# EAGLE design tmp006 (EAGLE 7.3.0)
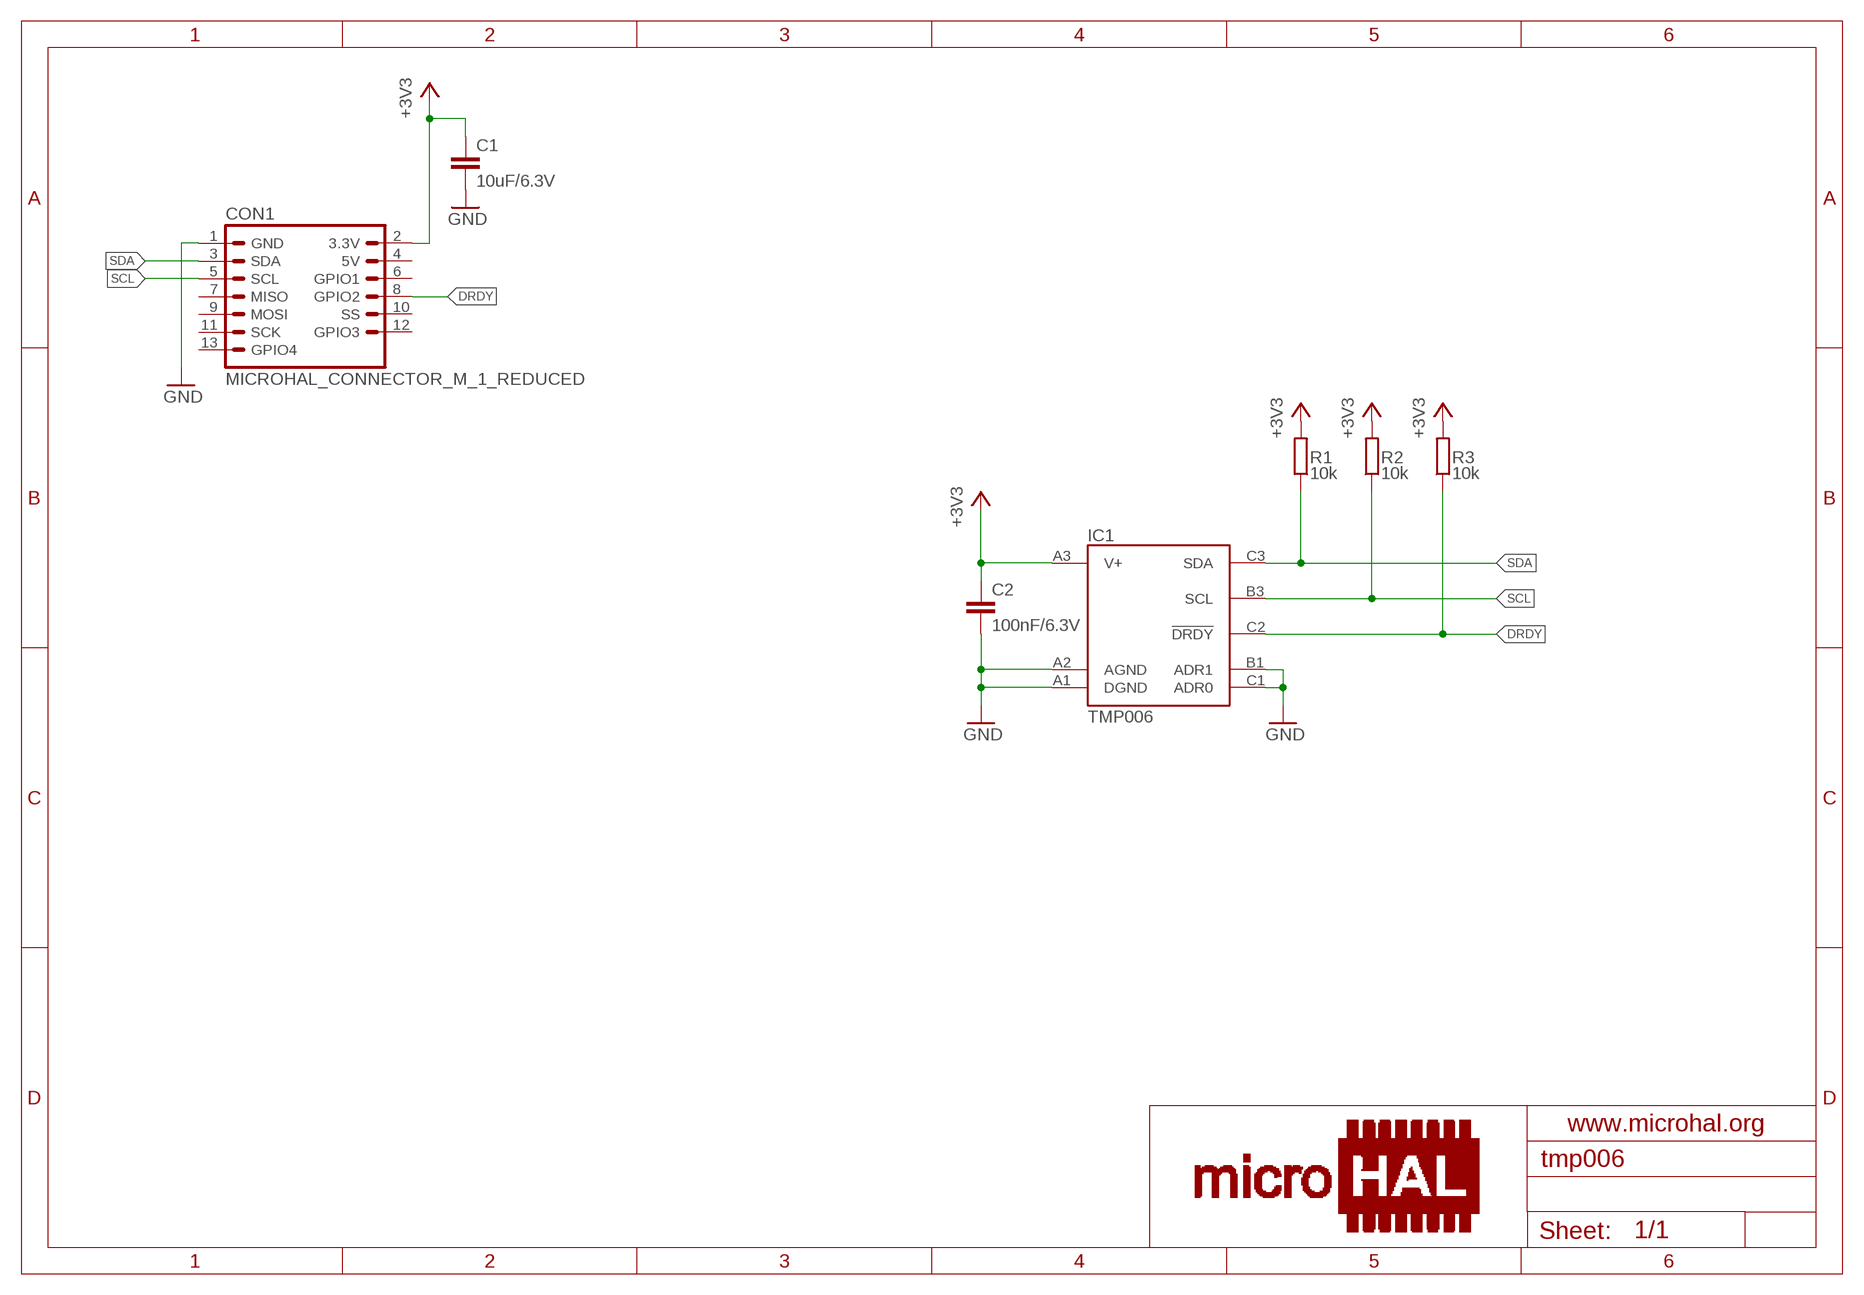
[diagram p0: schematic, sheet 1]

## Parts
C1  10uF/6.3V  C-EUC0805K  [C0805K]
C2  100nF/6.3V  C-EUC0603K  [C0603K]
CON1  MICROHAL_CONNECTOR_M_1_REDUCED  [MICROHAL_CONNECTOR_M_1_REDUCED_EDGE]
IC1  TMP006  [DSBGA-8]
R1  10k  R-EU_R0603  [R0603]
R2  10k  R-EU_R0603  [R0603]
R3  10k  R-EU_R0603  [R0603]

## Nets
+3V3: C1.1 C2.1 CON1.2(3.3V) IC1.A3(V+) R1.2 R2.2 R3.2
DRDY: CON1.8(GPIO2) IC1.C2(!DRDY) R3.1
GND: C1.2 C2.2 CON1.1(GND) IC1.A1(DGND) IC1.A2(AGND) IC1.B1(ADR1) IC1.C1(ADR0)
SCL: CON1.5(SCL) IC1.B3(SCL) R2.1
SDA: CON1.3(SDA) IC1.C3(SDA) R1.1
Unconnected: CON1.4(5V) CON1.6(GPIO1) CON1.7(MISO) CON1.9(MOSI) CON1.10(SS) CON1.11(SCK) CON1.12(GPIO3) CON1.13(GPIO4)

## Library data of the parts
C1 C2 = rcl:C-EU: CAPACITOR, European symbol
CON1 = microhal-connector_v0.1:MICROHAL_CONNECTOR_M_1_REDUCED
IC1 = tmp006:TMP006
R1-R3 = rcl:R-EU_: RESISTOR, European symbol

## Board
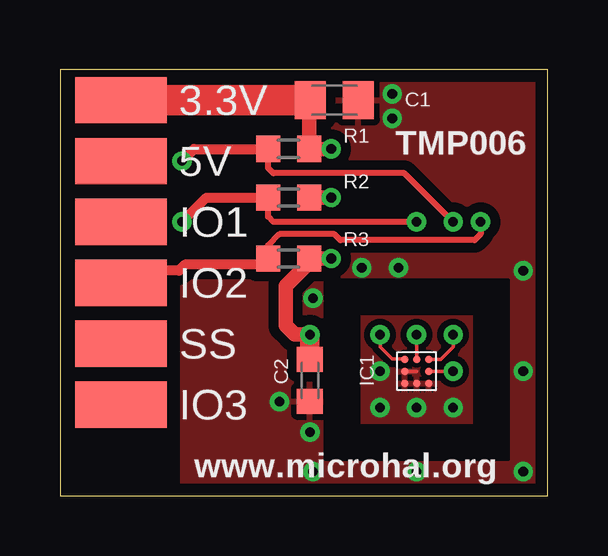
[diagram p1: board, top side]
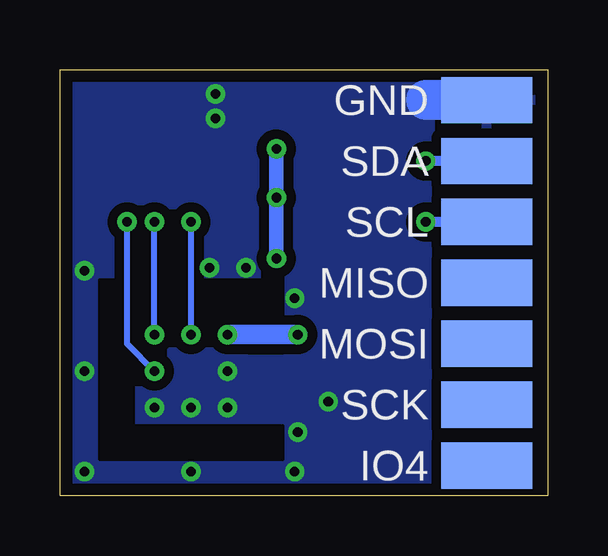
[diagram p2: board, bottom side, seen from below]

Size 20.32 x 17.78 mm. Coordinates in mm from the lower left corner, seen from the top.
Outline: 0,0 20.32,0 20.32,17.78 0,17.78 0,0
Copper layers (1*16): Top 0.035mm / dielectric 1.5mm / Bottom 0.035mm
Design rules "default *": minimum track width 6mil, minimum drill 14mil, track to track 8mil, track to pad 8mil, pad to pad 8mil, via to via 8mil, smd to smd 4mil, copper to edge 20mil, drill to drill 8mil, minimum pad ring 10mil, minimum via ring 8mil, stop-mask expansion 4mil, vias tented up to drill 16mil, thermal gap 10mil

### Footprints (pad centres in the part's own frame; a part is rotated, then mirrored left to right if it is on the bottom)
C0805K = smd 1.3 x 1.6: 1 -1,0; 2 1,0
C0603K = smd 1.05 x 1.08: 1 -0.875,0; 2 0.875,0
MICROHAL_CONNECTOR_M_1_REDUCED_EDGE = smd 1.93 x 3.81 bottom: 1 -7.62,0; 3 -5.08,0; 5 -2.54,0; 7 0,0; 9 2.54,0; 11 5.08,0; 13 7.62,0 | smd 1.93 x 3.81: 2 -7.62,0; 4 -5.08,0; 6 -2.54,0; 8 0,0; 10 2.54,0; 12 5.08,0
DSBGA-8 = smd 0.305 x 0.305: A1 -0.5,0.5; A2 0,0.5; A3 0.5,0.5; B1 -0.5,0; B3 0.5,0; C1 -0.5,-0.5; C2 0,-0.5; C3 0.5,-0.5
R0603 = smd 1 x 1.1: 1 -0.85,0; 2 0.85,0

### Placement (x,y rotation side)
C1  11.43,16.51 0 top
C2  10.41,4.83 270 top
CON1  2.54,8.89 270 top
IC1  14.86,5.21 90 top
R1  9.53,14.48 0 top
R2  9.53,12.45 0 top
R3  9.53,9.91 0 top

### Tracks (layer width: path | path; a pad name or v marks a point on that pad's centre or on a via)
+3V3  (via drill 0.4)
  Top 0.152: IC1.A3 13.84,5.71 13.34,6.22 v13.34,6.73
  Top 0.61: v10.41,6.73 9.78,6.73 9.4,7.11 9.4,8.76 10.38,9.74 R3.2 v11.3,9.91 | C1.1 10.38,16.45 R1.2 v11.3,14.48 | v11.3,12.45 R2.2
  Top 0.813: v10.41,6.73 C2.1
  Top 1.27: CON1.2 C1.1
  Bottom 0.61: v11.3,14.48 v11.3,12.45 v11.3,9.91
  Bottom 0.813: v13.34,6.73 v10.41,6.73
DRDY  (via drill 0.4)
  Top 0.152: IC1.C2 v16.38,5.21
  Top 0.254: v17.53,11.43 17.53,10.92 17.27,10.67 11.68,10.67 11.43,10.92 9.14,10.92 8.68,10.45 R3.1
  Top 0.406: R3.1 8.42,9.65 5.21,9.65 4.95,9.4 3.05,9.4 CON1.8
  Bottom 0.254: v17.53,11.43 17.53,6.35 v16.38,5.21
GND  (via drill 0.4)
  Top 0.152: IC1.A2 14.86,5.21
  Bottom 1.676: CON1.1 5.08,16.51
  other vias: 13.34,5.21 13.34,3.68 10.41,2.67 9.14,3.94 19.3,9.4 19.3,5.21 14.86,1.02 19.3,1.02 10.54,1.02 12.57,9.53 14.1,9.53 10.54,8.26 16.38,3.68 14.86,3.68 13.84,16.76 13.84,15.75
  pour Top (isolate 0.254, rank 4): 12.57,2.92 17.14,2.92 17.14,8.13 12.57,8.13 12.57,5.71 11.18,5.71 11.18,4.7 12.57,4.7
  pour Top (isolate 0.025, rank 2, no thermals): 14.67,5.02 15.05,5.02 15.05,5.4 14.67,5.4
  pour Top (isolate 0.406, rank 5): 20.32,17.78 20.32,0 5.08,0 5.08,17.78
  cutout Top: 18.67,9.02 18.67,1.52 11.05,1.52 11.05,5.08 12.45,5.08 12.45,2.92 17.27,2.92 17.27,7.62 12.45,7.62 12.45,5.21 11.05,5.21 11.05,9.02
  pour Bottom (isolate 0.406): 0,17.78 20.32,17.78 20.32,0 0,0
N$1
  cutout Bottom: 11.05,9.02 18.67,9.02 18.67,1.52 11.05,1.52 11.05,2.92 17.27,2.92 17.27,7.62 12.45,7.62 12.45,5.97 11.05,5.97
SCL  (via drill 0.4)
  Top 0.152: IC1.B3 v14.86,6.73
  Top 0.254: v14.86,11.43 8.89,11.43 8.68,11.64 R2.1
  Top 0.406: v5.08,11.43 6.1,12.45 R2.1
  Bottom 0.152: v14.86,6.73 14.86,7.11
  Bottom 0.254: 14.86,7.11 v14.86,11.43
  Bottom 0.406: CON1.5 v5.08,11.43
SDA  (via drill 0.4)
  Top 0.152: IC1.C3 15.87,5.71 16.38,6.22 v16.38,6.73
  Top 0.254: v16.38,11.43 14.35,13.46 8.89,13.46 8.68,13.68 R1.1
  Top 0.406: v5.08,13.97 5.59,14.48 R1.1
  Bottom 0.254: v16.38,6.73 v16.38,11.43
  Bottom 0.406: CON1.3 v5.08,13.97

### Text on the board
tPlace: TMP006 | www.microhal.org